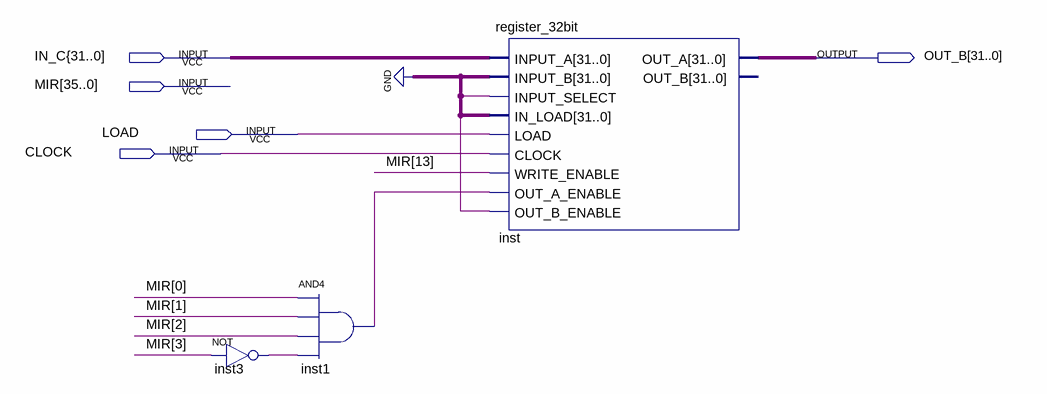
[diagram p0: schematic sheet]
// Quartus schematic TOS.bdf as structural Verilog: 3 symbols, 5 pins
module TOS (
  input  \IN_C{31..0] ,
  input  [35:0] MIR,
  input  LOAD,
  input  CLOCK,
  output [31:0] OUT_B
);

  wire inst1_out, inst3_out, undriven_2, undriven_3;
  wire [31:0] undriven;

  not inst3 (inst3_out, MIR[3]);
  and inst1 (inst1_out, MIR[0], MIR[1], MIR[2], inst3_out);
  register_32bit inst (
    .INPUT_A(undriven), .INPUT_B({32{1'b0}}), .INPUT_SELECT(undriven_2), .IN_LOAD({32{1'b0}}), .LOAD(LOAD),
    .CLOCK(CLOCK), .WRITE_ENABLE(MIR[13]), .OUT_A_ENABLE(inst1_out), .OUT_B_ENABLE(undriven_3), .OUT_A(OUT_B));  // open: OUT_B
endmodule
